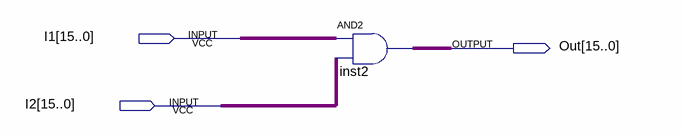
[diagram p0: schematic sheet]
// Quartus schematic 16bitcmp.bdf as structural Verilog: 1 symbols, 3 pins
module \16bitcmp  (
  input  [15:0] I1,
  input  [15:0] I2,
  output [15:0] Out
);

  assign Out = I1 & I2;  // AND2 inst2, 16 bits wide
endmodule
